# Altium schematic sheet BoomClock.SchDoc: BoomClock
size A4; SheetNumber: 1; SheetTotal: 1; SPICEModelCacheXHVSVVYB: <root> / <DocumentId>XHVSVVYB</DocumentId> / </root>
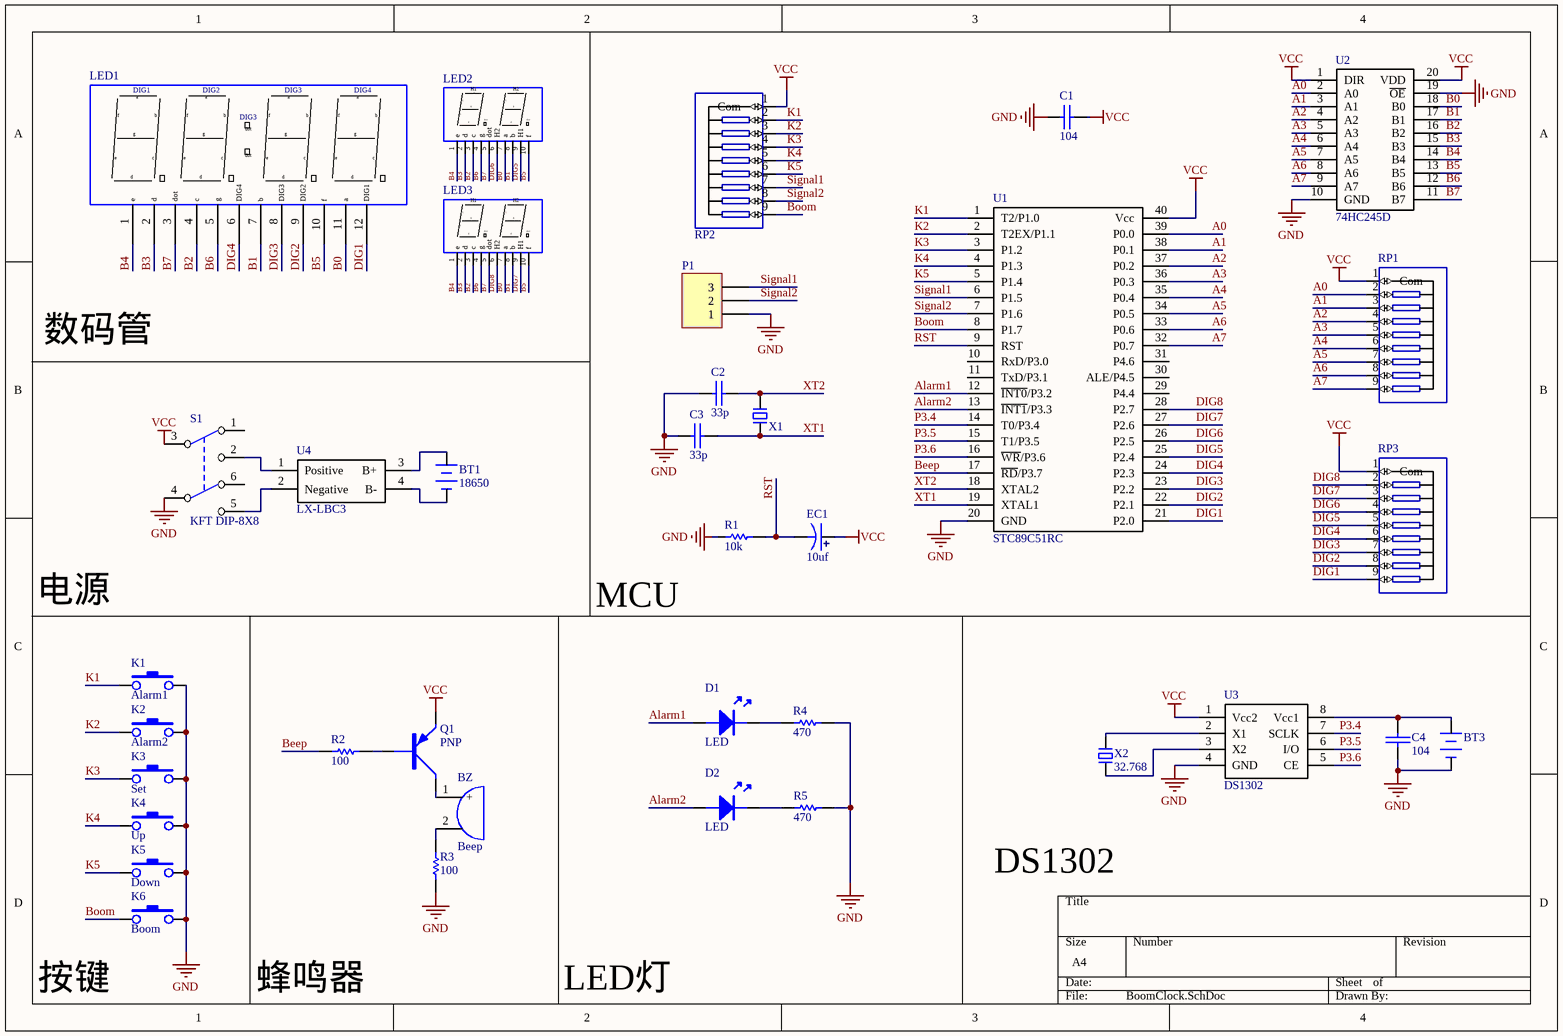
[diagram p0: BoomClock.SchDoc]

## Parts
BT1  18650  [Battery_18650]
BT3  Battery  [Battery_CR2032]  (value not drawn)
BZ  Beep  [Beep]
C1  104  [RAD-0.1]
C2  33p  [RAD-0.1]
C3  33p  [RAD-0.1]
C4  104  [RAD-0.1]
D1  LED  [LED5-YEL]
D2  LED  [LED5-BLUE]
EC1  10uf  [DIP-EC1.5X4X8]
K1  Alarm1  [DIP-6X6X5]
K2  Alarm2  [DIP-6X6X5]
K3  Set  [DIP-6X6X5]
K4  Up  [DIP-6X6X5]
K5  Down  [DIP-6X6X5]
K6  Boom  [DIP-12X12X8]
LED1  Digital_4_time  [Digital_4_time]  (value not drawn)
LED2  Digital_2  [Digital_2]  (value not drawn)
LED3  Digital_2  [Digital_2]  (value not drawn)
P1  Header 3  [HDR1X3]  (value not drawn)
Q1  PNP  [SOT-23]
R1  10k  [0805R]
R2  100  [0805R]
R3  100  [0805R]
R4  470  [AXIAL0.4]
R5  470  [AXIAL0.4]
RP1  RES_PACK9  [A09R]  (value not drawn)
RP2  RES_PACK9  [A09R]  (value not drawn)
RP3  RES_PACK9  [A09R]  (value not drawn)
S1  KFT DIP-8X8  [KFT DIP-8X8]
U1  STC89C51RC  [DIP40]
U2  74HC245D  [SOP20]
U3  DS1302  [DIP8]
U4  LX-LBC3  [LX-LBC3]
X1  XTAL-2P  [OSC HC-49S]  (value not drawn)
X2  32.768  [OSC-2x6-WI-A]

## Nets
GND: BT3.2(Negative) C1.1 C2.1 C3.1 C4.1 K1.2 K2.2 K3.2 K4.2 K5.2 K6.2 P1.1 R1.1 R3.1 R4.2 R5.2 S1.4 U1.20(GND) U2.10(GND) U2.19(~{OE}) U3.4(GND)
VCC: C1.2 EC1.1 Q1.E RP1.1(Com) RP2.1(Com) RP3.1(Com) S1.3 U1.40(Vcc) U2.1(DIR) U2.20(VDD) U3.1(Vcc2)
A0: RP1.2 U1.39(P0.0) U2.2(A0)
A1: RP1.3 U1.38(P0.1) U2.3(A1)
A2: RP1.4 U1.37(P0.2) U2.4(A2)
A3: RP1.5 U1.36(P0.3) U2.5(A3)
A4: RP1.6 U1.35(P0.4) U2.6(A4)
A5: RP1.7 U1.34(P0.5) U2.7(A5)
A6: RP1.8 U1.33(P0.6) U2.8(A6)
A7: RP1.9 U1.32(P0.7) U2.9(A7)
Alarm1: D1.A U1.12(~{INT0}/P3.2)
Alarm2: D2.A U1.13(~{INT1}/P3.3)
B0: LED1.11(a) LED2.7(a) LED3.7(a) U2.18(B0)
B1: LED1.7(b) LED2.8(b) LED3.8(b) U2.17(B1)
B2: LED1.4(c) LED2.3(c) LED3.3(c) U2.16(B2)
B3: LED1.2(d) LED2.2(d) LED3.2(d) U2.15(B3)
B4: LED1.1(e) LED2.1(e) LED3.1(e) U2.14(B4)
B5: LED1.10(f) LED2.10(f) LED3.10(f) U2.13(B5)
B6: LED1.5(g) LED2.4(g) LED3.4(g) U2.12(B6)
B7: LED1.3(dot) LED2.5(dot) LED3.5(dot) U2.11(B7)
Beep: R2.1 U1.17(~{RD}/P3.7)
Boom: K6.1 RP2.9 U1.8(P1.7)
DIG1: LED1.12(DIG1) RP3.9 U1.21(P2.0)
DIG2: LED1.9(DIG2) RP3.8 U1.22(P2.1)
DIG3: LED1.8(DIG3) RP3.7 U1.23(P2.2)
DIG4: LED1.6(DIG4) RP3.6 U1.24(P2.3)
DIG5: LED2.9(H1) RP3.5 U1.25(P2.4)
DIG6: LED2.6(H2) RP3.4 U1.26(P2.5)
DIG7: LED3.9(H1) RP3.3 U1.27(P2.6)
DIG8: LED3.6(H2) RP3.2 U1.28(P2.7)
K1: K1.1 RP2.2 U1.1(T2/P1.0)
K2: K2.1 RP2.3 U1.2(T2EX/P1.1)
K3: K3.1 RP2.4 U1.3(P1.2)
K4: K4.1 RP2.5 U1.4(P1.3)
K5: K5.1 RP2.6 U1.5(P1.4)
P3.4: U1.14(T0/P3.4) U3.7(SCLK)
P3.5: U1.15(T1/P3.5) U3.6(I/O)
P3.6: U1.16(~{WR}/P3.6) U3.5(CE)
RST: EC1.2 R1.2 U1.9(RST)
Signal1: P1.3 RP2.7 U1.6(P1.5)
Signal2: P1.2 RP2.8 U1.7(P1.6)
XT1: C3.2 U1.19(XTAL1) X1.1
XT2: C2.2 U1.18(XTAL2) X1.2
NetBT1_1: BT1.1(Positive) U4.3(B+)
NetBT1_2: BT1.2(Negative) U4.4(B-)
NetBT3_1: BT3.1(Positive) C4.2 U3.8(Vcc1)
NetBZ_1: BZ.1 Q1.C
NetBZ_2: BZ.2 R3.2
NetD1_K: D1.K R4.1
NetD2_K: D2.K R5.1
NetQ1_B: Q1.B R2.2
NetS1_2: S1.2 U4.1(Positive)
NetS1_5: S1.5 U4.2(Negative)
NetU3_2: U3.2(X1) X2.2
NetU3_3: U3.3(X2) X2.1

Not connected (* = marked no-connect by the designer): S1 1 6; U1 10(RxD/P3.0) 11(TxD/P3.1) 29(P4.4) 30(ALE/P4.5) 31(P4.6)

## Notes on the sheet
- 数码管
- 电源
- MCU
- DS1302
- 按键
- 蜂鸣器
- LED灯
- (in symbol Beep) +

## Library data of the parts
BT1 BT3 = Battery: 电池
BZ = Beep: 蜂鸣器
C1-C4 = CAP: 无极性电容
EC1 = DIP_ECAP: 直插电解电容
K1-K6 = KEY: 按动开关
LED1 = Digital_4_time: 四位时间数码管
LED2 LED3 = Digital_2: 二位数码管
P1 = Header 3: Header, 3-Pin; LatestRevisionDate: 17-Jul-2002; LatestRevisionNote: Re-released for DXP Platform.; Publisher: Altium Limited
Q1 = PNP: PNP三极管
R1-R5 = RES: 电阻
RP1-RP3 = RES_PACK9: 排阻
U4 = LX-LBC3: 电源模块
X1 X2 = XTAL-2P: 2脚无源脚晶振